# Altium schematic sheet 10ms Debouncer.SchDoc
size A4
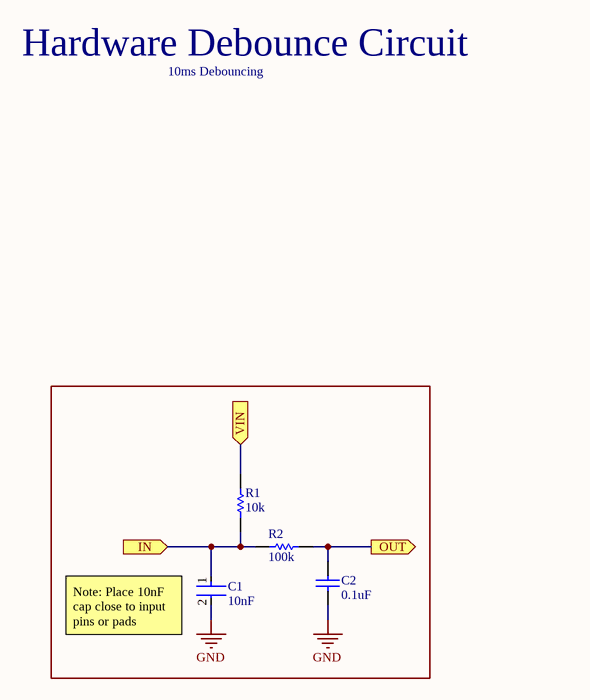
[diagram p0: 10ms Debouncer.SchDoc]

## Parts
C1  10nF  [FP-CL21-IPC_A]
C2  0.1uF  [CAPC2013X95X45ML10T25]
R1  10k  [RESC2013X70X40LL20T20]
R2  100k  [RESC2013X70X40ML20T20]

## Ports
IN (in), OUT (out), VIN (in)

## Nets
GND: C1.2 C2.2
IN: C1.1 R1.1 R2.1 ; port IN
OUT: C2.1 R2.2 ; port OUT
VIN: R1.2 ; port VIN

## Notes on the sheet
- Hardware Debounce Circuit
- 10ms Debouncing
- (near C1) Note: Place 10nF cap close to input pins or pads

## Library data of the parts
C1 = CMP-13271-003077-1: CL21 Series 0805 10nF 100V ±10% Tolerance X7R Multilayer Ceramic Chip Capacitor; Manufacturer: Samsung; Manufacturer Part Number: CL21B103KCANNNC; Voltage: 100V; Contact Plating: Tin; Height: 0.65mm; Thickness: 0.03inch; Min Operating Temperature: -55°C; Capacitance: 10nF; Length: 2mm; Max Operating Temperature: 125°C; Case Code (Imperial): 0805; Radiation Hardening: No; Dielectric: X7R; Material: Ceramic; Depth: 1.25mm; Voltage Rating: 100V; Case/Package: 0805; Tolerance: 10%; Package Quantity: 1; Width: 0.049inch; Mount: Surface Mount; Case Code (Metric): 2012; Packaging: Tape and Reel; Supplier 1: LCSC; Supplier Part Number 1: C18741; RoHS: Yes; Category: Ceramic Capacitors; Stock 1: 30550; Pricing 1: 50=0.01480, 500=0.01090, 1500=0.01020, 5000=0.00950, 25000=0.00920, 50000=0.00900, 50=0.01390, 500=0.01030, 1500=0.00960, 5000=0.00890, 25000=0.00860, 50000=0.00850, 50=0.07070, 500=0.05230, 1500=0.04900, 5000=0.04560, 25000=0.04410, 50000=0.04330, 50=0.06640, 500=0.04910, 1500=0.04590, 5000=0.04270, 25000=0.04130, 50000=0.04060, 50=0.00890, 500=0.00660, 1500=0.00620, 5000=0.00570, 25000=0.00560, 50000=0.00550, 50=0.00810, 500=0.00600, 1500=0.00560, 5000=0.00520, 25000=0.00510, 50000=0.00500, 50=0.08030, 500=0.05940, 1500=0.05560, 5000=0.05180, 25000=0.05010, 50000=0.04920, 50=1.09470, 500=0.80990, 1500=0.75750, 5000=0.70520, 25000=0.68200, 50000=0.67050, 50=0.04320, 500=0.03200, 1500=0.02990, 5000=0.02790, 25000=0.02690, 50000=0.02650, 50=0.81020, 500=0.59940, 1500=0.56060, 5000=0.52190, 25000=0.50480, 50000=0.49620, 50=0.09470, 500=0.07010, 1500=0.06550, 5000=0.06100, 25000=0.05900, 50000=0.05800, 50=0.01430, 500=0.01060, 1500=0.00990, 5000=0.00920, 25000=0.00890, 50000=0.00880, 50=0.01037, 500=0.00767, 1500=0.00717, 5000=0.00668, 25000=0.00646, 50000=0.00635 (AUD); ComponentLink1URL: https://datasheet.ciiva.com/15195/getdatasheetpartid-494350-15195869.pdf?src-supplier=Verical; ComponentLink1Description: https://datasheet.ciiva.com/15195/getdatasheetpartid-494350-15195869.pdf?src-supplier=Verical; ComponentLink2URL: https://datasheet.ciiva.com/29199/455069-da-01-en-vs-kondensator-0805-29199454.pdf?src-supplier=Conrad; ComponentLink2Description: https://datasheet.ciiva.com/29199/455069-da-01-en-vs-kondensator-0805-29199454.pdf?src-supplier=Conrad; ComponentLink3URL: https://datasheet.ciiva.com/26310/mlcc-catalogdownload2013-eng-26310214.pdf?src-supplier=Distrelec; ComponentLink3Description: https://datasheet.ciiva.com/26310/mlcc-catalogdownload2013-eng-26310214.pdf?src-supplier=Distrelec; ComponentLink4URL: https://datasheet.ciiva.com/16351/cl21b103kcannnc-16351132.pdf?src-supplier=Future+Electronics; ComponentLink4Description: https://datasheet.ciiva.com/16351/cl21b103kcannnc-16351132.pdf?src-supplier=Future+Electronics; Supplier 2: Digi-Key; Supplier Part Number 2: 1276-1249-1-ND; Stock 2: 123480; Pricing 2: 1=0.10000, 10=0.03900, 50=0.02140, 100=0.01740, 500=0.01244, 1000=0.00977 (USD)
C2 = CMP-2000-05017-1: Chip Capacitor, 0.1 uF, +/- 10%, 50 V, 0805 (2012 Metric), RoHS, Tape and Reel; Manufacturer: Samsung Electro-Mechanics; Manufacturer Part Number: CL21B104KBCNNNC; Dielectric: X7R; Capacitance: 100000pF; Rated Voltage: 50V; Material: Ceramic; Tolerance (%): ±10%; Case Size/Dimension: 0805; Datasheet URL: http://www.samsungsem.com/kr/support/product-search/mlcc/__icsFiles/afieldfile/2015/08/14/S_CL21B104KBCNNNC.pdf; Package Reference: 805; Package Description: 2-Pin Surface Mount Device, Body 2 x 1.25 mm; Manufacturer URL: http://www.samsungsem.com/global/index.jsp; Datasheet Version: Jun-15; Supplier 1: LCSC; Supplier Part Number 1: C1711; RoHS: Yes; Category: Ceramic Capacitors; Stock 1: 1573200; Pricing 1: 50=0.01180, 500=0.00860, 1500=0.00810, 5000=0.00750, 25000=0.00710, 50000=0.00710, 50=0.01140, 500=0.00830, 1500=0.00780, 5000=0.00720, 25000=0.00690, 50000=0.00680, 50=0.05850, 500=0.04280, 1500=0.04000, 5000=0.03710, 25000=0.03520, 50000=0.03490, 50=0.05440, 500=0.03980, 1500=0.03710, 5000=0.03450, 25000=0.03280, 50000=0.03250, 50=0.00730, 500=0.00530, 1500=0.00500, 5000=0.00460, 25000=0.00440, 50000=0.00440, 50=0.00670, 500=0.00490, 1500=0.00460, 5000=0.00420, 25000=0.00400, 50000=0.00400, 50=0.06710, 500=0.04910, 1500=0.04580, 5000=0.04260, 25000=0.04040, 50000=0.04010, 50=0.90790, 500=0.66380, 1500=0.61990, 5000=0.57600, 25000=0.54670, 50000=0.54190, 50=0.03570, 500=0.02610, 1500=0.02440, 5000=0.02270, 25000=0.02150, 50000=0.02130, 50=0.64940, 500=0.47480, 1500=0.44340, 5000=0.41200, 25000=0.39110, 50000=0.38760, 50=0.07600, 500=0.05560, 1500=0.05190, 5000=0.04820, 25000=0.04580, 50000=0.04530, 50=0.01170, 500=0.00860, 1500=0.00800, 5000=0.00750, 25000=0.00710, 50000=0.00700, 50=0.00866, 500=0.00633, 1500=0.00591, 5000=0.00549, 25000=0.00521, 50000=0.00517 (AUD); Mount: Surface Mount; Case/Package: 0805; Case Code (Metric): 2012; Case Code (Imperial): 0805; Contact Plating: Tin; Min Operating Temperature: -55°C; Max Operating Temperature: 125°C; Tolerance: 10%; Packaging: Tape and Reel; Voltage Rating: 50V; Voltage Rating (DC): 50V; Voltage: 50V; Length: 2mm; Height: 0.85mm; Width: 0.049inch; Depth: 1.25mm; Thickness: 0.037inch; Radiation Hardening: No; Lead Free: Lead Free; ComponentLink1URL: https://datasheet.ciiva.com/25710/cl21b104kbcnnnc-25710182.pdf?src-supplier=Digi-Key; ComponentLink1Description: https://datasheet.ciiva.com/25710/cl21b104kbcnnnc-25710182.pdf?src-supplier=Digi-Key; ComponentLink2URL: https://datasheet.ciiva.com/29199/454152-da-01-en-vs-kondensator-0805-29199814.pdf?src-supplier=Conrad; ComponentLink2Description: https://datasheet.ciiva.com/29199/454152-da-01-en-vs-kondensator-0805-29199814.pdf?src-supplier=Conrad; Supplier 2: Digi-Key; Supplier Part Number 2: 1276-1003-1-ND; Stock 2: 2187571; Pricing 2: 1=0.10000, 10=0.04700, 50=0.02560, 100=0.02100, 500=0.01498, 1000=0.01177 (USD)
R1 = CMP-2001-00337-1: Part Number: ERJ-6GEYJ103V; Manufacturer: Panasonic; Resistance: 10kR; Power Rating: 125mW; Voltage Rating: 150V; Temperature Coefficient: 200ppm/°C; Tolerance: 5%; Supplier 1: LCSC; Supplier Part Number 1: C180849; Manufacturer Part Number: ERJ-6GEYJ103V; RoHS: Yes; Category: Chip SMD Resistors; Stock 1: 32950; Pricing 1: 50=0.00990, 500=0.00730, 1500=0.00680, 5000=0.00640, 25000=0.00620, 50000=0.00600, 50=0.00950, 500=0.00710, 1500=0.00660, 5000=0.00610, 25000=0.00590, 50000=0.00580, 50=0.04900, 500=0.03620, 1500=0.03380, 5000=0.03150, 25000=0.03040, 50000=0.02990, 50=0.04560, 500=0.03360, 1500=0.03150, 5000=0.02930, 25000=0.02830, 50000=0.02780, 50=0.00610, 500=0.00450, 1500=0.00420, 5000=0.00390, 25000=0.00380, 50000=0.00370, 50=0.00560, 500=0.00410, 1500=0.00390, 5000=0.00360, 25000=0.00350, 50000=0.00340, 50=0.05620, 500=0.04150, 1500=0.03880, 5000=0.03610, 25000=0.03490, 50000=0.03430, 50=0.76080, 500=0.56170, 1500=0.52510, 5000=0.48850, 25000=0.47230, 50000=0.46430, 50=0.02990, 500=0.02210, 1500=0.02070, 5000=0.01920, 25000=0.01860, 50000=0.01830, 50=0.54420, 500=0.40180, 1500=0.37560, 5000=0.34940, 25000=0.33780, 50000=0.33210, 50=0.06370, 500=0.04700, 1500=0.04390, 5000=0.04090, 25000=0.03950, 50000=0.03890, 50=0.00980, 500=0.00730, 1500=0.00680, 5000=0.00630, 25000=0.00610, 50000=0.00600, 50=0.00726, 500=0.00536, 1500=0.00501, 5000=0.00466, 25000=0.00450, 50000=0.00443 (AUD); Mount: Surface Mount; Case/Package: 0805; Case Code (Metric): 2012; Case Code (Imperial): 0805; Contact Plating: Tin; Min Operating Temperature: -55°C; Max Operating Temperature: 155°C; Packaging: Tape and Reel; Termination: SMD/SMT; Resistor Type: Thick Film; Voltage Rating (DC): 150V; Package Quantity: 5000; Number of Terminations: 2; Max Power Dissipation: 125mW; Features: Automotive AEC-Q200; Length: 2mm; Height: 0.6mm; Width: 0.049inch; Depth: 1.25mm; Radiation Hardening: No; Lead Free: Lead Free; REACH SVHC: No SVHC; Military Standard: Not; ComponentLink1URL: https://datasheet.ciiva.com/11821/0900766b80f806dd-11821504.pdf?src-supplier=RSComponents; ComponentLink1Description: https://datasheet.ciiva.com/11821/0900766b80f806dd-11821504.pdf?src-supplier=RSComponents; ComponentLink2URL: https://datasheet.ciiva.com/46386/1500035-46386469.pdf?src-supplier=Element14; ComponentLink2Description: https://datasheet.ciiva.com/46386/1500035-46386469.pdf?src-supplier=Element14; ComponentLink3URL: https://datasheet.ciiva.com/30128/4aoa0000ce1-30128839.pdf?src-supplier=Onlinecomponents.com; ComponentLink3Description: https://datasheet.ciiva.com/30128/4aoa0000ce1-30128839.pdf?src-supplier=Onlinecomponents.com; ComponentLink4URL: https://datasheet.ciiva.com/16428/aoa0000ce1-16428072.pdf?src-supplier=Future+Electronics; ComponentLink4Description: https://datasheet.ciiva.com/16428/aoa0000ce1-16428072.pdf?src-supplier=Future+Electronics; ComponentLink5URL: https://datasheet.ciiva.com/16782/70255313-16782712.pdf?src-supplier=Allied+Electronics; ComponentLink5Description: https://datasheet.ciiva.com/16782/70255313-16782712.pdf?src-supplier=Allied+Electronics; ComponentLink6URL: https://datasheet.ciiva.com/9117/aoa0000ce1-9117371.pdf?src-supplier=Avnet; ComponentLink6Description: https://datasheet.ciiva.com/9117/aoa0000ce1-9117371.pdf?src-supplier=Avnet; ComponentLink7URL: https://datasheet.ciiva.com/17212/aoa0000ce1-17212110.pdf?src-supplier=Avnet+Europe; ComponentLink7Description: https://datasheet.ciiva.com/17212/aoa0000ce1-17212110.pdf?src-supplier=Avnet+Europe; ComponentLink8URL: https://datasheet.ciiva.com/16787/70255313-16787775.pdf?src-supplier=Allied+Electronics; ComponentLink8Description: https://datasheet.ciiva.com/16787/70255313-16787775.pdf?src-supplier=Allied+Electronics; ComponentLink9URL: https://datasheet.ciiva.com/22785/1500035-22785957.pdf?src-supplier=Farnell; ComponentLink9Description: https://datasheet.ciiva.com/22785/1500035-22785957.pdf?src-supplier=Farnell; ComponentLink10URL: https://datasheet.ciiva.com/28514/1678796-28514236.pdf?src-supplier=Element14; ComponentLink10Description: https://datasheet.ciiva.com/28514/1678796-28514236.pdf?src-supplier=Element14; ComponentLink11URL: https://datasheet.ciiva.com/43460/1500035-43460125.pdf?src-supplier=Farnell; ComponentLink11Description: https://datasheet.ciiva.com/43460/1500035-43460125.pdf?src-supplier=Farnell; Supplier 2: Digi-Key; Supplier Part Number 2: P10KACT-ND; Stock 2: 3512979; Pricing 2: 1=0.10000, 10=0.04900, 100=0.02010, 1000=0.00901, 2500=0.00782 (USD)
R2 = CMP-2001-04377-1: Part Number: ERJ-6ENF1003V; Manufacturer: Panasonic; Resistance: 100kR; Tolerance: 1%; Temperature Coefficient: 100ppm/°C; Power Rating: 125mW; Voltage Rating: 150V; Supplier 1: LCSC; Supplier Part Number 1: C169252; Manufacturer Part Number: ERJ-6ENF1003V; RoHS: Yes; Category: Chip SMD Resistors; Stock 1: 1000; Pricing 1: 50=0.01490, 500=0.01090, 1500=0.01020, 5000=0.00950, 25000=0.00910, 50000=0.00900, 50=0.01430, 500=0.01050, 1500=0.00980, 5000=0.00910, 25000=0.00880, 50000=0.00870, 50=0.07350, 500=0.05400, 1500=0.05040, 5000=0.04680, 25000=0.04520, 50000=0.04450, 50=0.06830, 500=0.05020, 1500=0.04690, 5000=0.04350, 25000=0.04200, 50000=0.04130, 50=0.00920, 500=0.00670, 1500=0.00630, 5000=0.00590, 25000=0.00570, 50000=0.00560, 50=0.00840, 500=0.00620, 1500=0.00580, 5000=0.00540, 25000=0.00520, 50000=0.00510, 50=0.08430, 500=0.06190, 1500=0.05780, 5000=0.05370, 25000=0.05190, 50000=0.05100, 50=1.14010, 500=0.83770, 1500=0.78210, 5000=0.72650, 25000=0.70190, 50000=0.68960, 50=0.04490, 500=0.03300, 1500=0.03080, 5000=0.02860, 25000=0.02760, 50000=0.02710, 50=0.81550, 500=0.59920, 1500=0.55940, 5000=0.51970, 25000=0.50210, 50000=0.49330, 50=0.09540, 500=0.07010, 1500=0.06550, 5000=0.06080, 25000=0.05870, 50000=0.05770, 50=0.01480, 500=0.01080, 1500=0.01010, 5000=0.00940, 25000=0.00910, 50000=0.00890, 50=0.01087, 500=0.00799, 1500=0.00746, 5000=0.00693, 25000=0.00669, 50000=0.00658 (AUD); Mount: Surface Mount; Case/Package: 0805; Number of Pins: 2; Case Code (Metric): 2012; Case Code (Imperial): 0805; Contact Plating: Tin; Min Operating Temperature: -55°C; Max Operating Temperature: 155°C; Packaging: Tape and Reel; Resistor Type: Thick Film; Termination: SMD/SMT; Voltage Rating (DC): 150V; Package Quantity: 1; Number of Terminations: 2; Max Power Dissipation: 125mW; Features: Automotive AEC-Q200; Length: 2mm; Height: 0.6mm; Width: 0.049inch; Depth: 1.25mm; Radiation Hardening: No; Lead Free: Lead Free; REACH SVHC: No SVHC; Military Standard: Not; ComponentLink1URL: https://datasheet.ciiva.com/11821/0900766b80f80784-11821507.pdf?src-supplier=RSComponents; ComponentLink1Description: https://datasheet.ciiva.com/11821/0900766b80f80784-11821507.pdf?src-supplier=RSComponents; ComponentLink2URL: https://datasheet.ciiva.com/22723/426256-22723909.pdf?src-supplier=Element14; ComponentLink2Description: https://datasheet.ciiva.com/22723/426256-22723909.pdf?src-supplier=Element14; ComponentLink3URL: https://datasheet.ciiva.com/46419/1678782-46419877.pdf?src-supplier=Element14; ComponentLink3Description: https://datasheet.ciiva.com/46419/1678782-46419877.pdf?src-supplier=Element14; ComponentLink4URL: https://datasheet.ciiva.com/27055/1988989-27055734.pdf?src-supplier=Jameco; ComponentLink4Description: https://datasheet.ciiva.com/27055/1988989-27055734.pdf?src-supplier=Jameco; ComponentLink5URL: https://datasheet.ciiva.com/16449/aoa0000ce2-16449480.pdf?src-supplier=Future+Electronics; ComponentLink5Description: https://datasheet.ciiva.com/16449/aoa0000ce2-16449480.pdf?src-supplier=Future+Electronics; ComponentLink6URL: https://datasheet.ciiva.com/17208/aoa0000ce2-17208153.pdf?src-supplier=Avnet+Europe; ComponentLink6Description: https://datasheet.ciiva.com/17208/aoa0000ce2-17208153.pdf?src-supplier=Avnet+Europe; ComponentLink7URL: https://datasheet.ciiva.com/22667/1678782-22667897.pdf?src-supplier=Element14; ComponentLink7Description: https://datasheet.ciiva.com/22667/1678782-22667897.pdf?src-supplier=Element14; ComponentLink8URL: https://datasheet.ciiva.com/24023/aoa0000ce2-24023497.pdf?src-supplier=Mouser; ComponentLink8Description: https://datasheet.ciiva.com/24023/aoa0000ce2-24023497.pdf?src-supplier=Mouser; ComponentLink9URL: https://datasheet.ciiva.com/30257/aoa0000ce2-30257690.pdf?src-supplier=Onlinecomponents.com; ComponentLink9Description: https://datasheet.ciiva.com/30257/aoa0000ce2-30257690.pdf?src-supplier=Onlinecomponents.com; ComponentLink10URL: https://datasheet.ciiva.com/7830/426256-7830988.pdf?src-supplier=Element14; ComponentLink10Description: https://datasheet.ciiva.com/7830/426256-7830988.pdf?src-supplier=Element14; ComponentLink11URL: https://datasheet.ciiva.com/16776/70260748-16776892.pdf?src-supplier=Allied+Electronics; ComponentLink11Description: https://datasheet.ciiva.com/16776/70260748-16776892.pdf?src-supplier=Allied+Electronics; ComponentLink12URL: https://datasheet.ciiva.com/16788/70260748-16788734.pdf?src-supplier=Allied+Electronics; ComponentLink12Description: https://datasheet.ciiva.com/16788/70260748-16788734.pdf?src-supplier=Allied+Electronics; ComponentLink13URL: https://datasheet.ciiva.com/7830/426256-7830746.pdf?src-supplier=Element14; ComponentLink13Description: https://datasheet.ciiva.com/7830/426256-7830746.pdf?src-supplier=Element14; ComponentLink14URL: https://datasheet.ciiva.com/48531/aoa0000ce2-48531486.pdf?src-supplier=Avnet; ComponentLink14Description: https://datasheet.ciiva.com/48531/aoa0000ce2-48531486.pdf?src-supplier=Avnet; Supplier 2: Digi-Key; Supplier Part Number 2: P100KCCT-ND; Stock 2: 1249390; Pricing 2: 1=0.10000, 10=0.06500, 100=0.02500, 1000=0.01100, 2500=0.00950 (USD)